# EAGLE schematic brmecg-pwr (EAGLE 6.1)
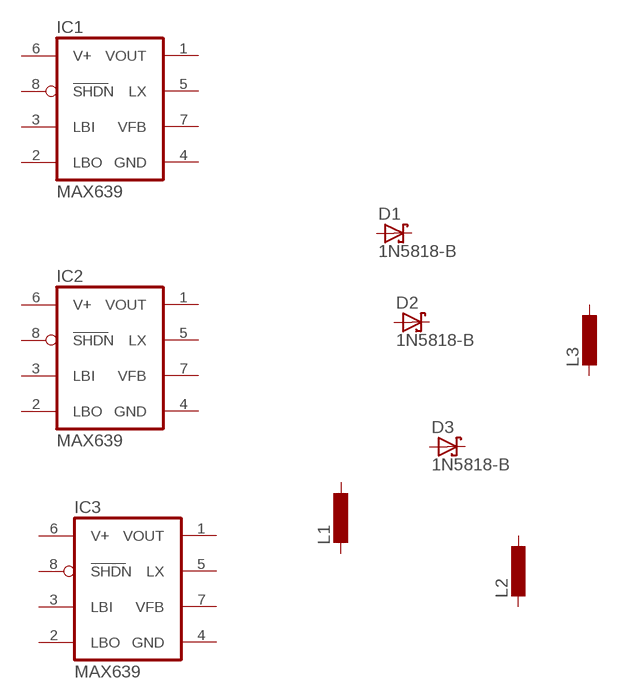
[diagram p0: schematic, sheet 1]

## Parts
D1  1N5818-B  [DO41-7.6]
D2  1N5818-B  [DO41-7.6]
D3  1N5818-B  [DO41-7.6]
IC1  MAX639  [DIL08]
IC2  MAX639  [DIL08]
IC3  MAX639  [DIL08]
L1  L-EUL1812  [L1812]
L2  L-EUL1812  [L1812]
L3  L-EUL1812  [L1812]
Unconnected: D1.A D1.C D2.A D2.C D3.A D3.C IC1.1(VOUT) IC1.2(LBO) IC1.3(LBI) IC1.5(LX) IC1.7(VFB) IC1.8(SHDN) IC2.1(VOUT) IC2.2(LBO) IC2.3(LBI) IC2.5(LX) IC2.7(VFB) IC2.8(SHDN) IC3.1(VOUT) IC3.2(LBO) IC3.3(LBI) IC3.5(LX) IC3.7(VFB) IC3.8(SHDN) L1.1 L1.2 L2.1 L2.2 L3.1 L3.2

## Power pins joined to a net without a drawn wire
GND: IC1.4(GND) IC2.4(GND) IC3.4(GND)
V+: IC1.6(V+) IC2.6(V+) IC3.6(V+)

## Library data of the parts
D1-D3 = diode:1N581*: 1.0A SCHOTTKY BARRIER RECTIFIER Source: http://www.diodes.com/datasheets/ds23001.pdf
IC1-IC3 = maxim:MAX639: Step-down SWITCHING REGULATOR; OC_FARNELL: 459604; OC_NEWARK: unknown
L1-L3 = rcl:L-EU: INDUCTOR, European symbol